# EAGLE schematic esp32-gps-eth-v9exp (EAGLE 7.3.0)
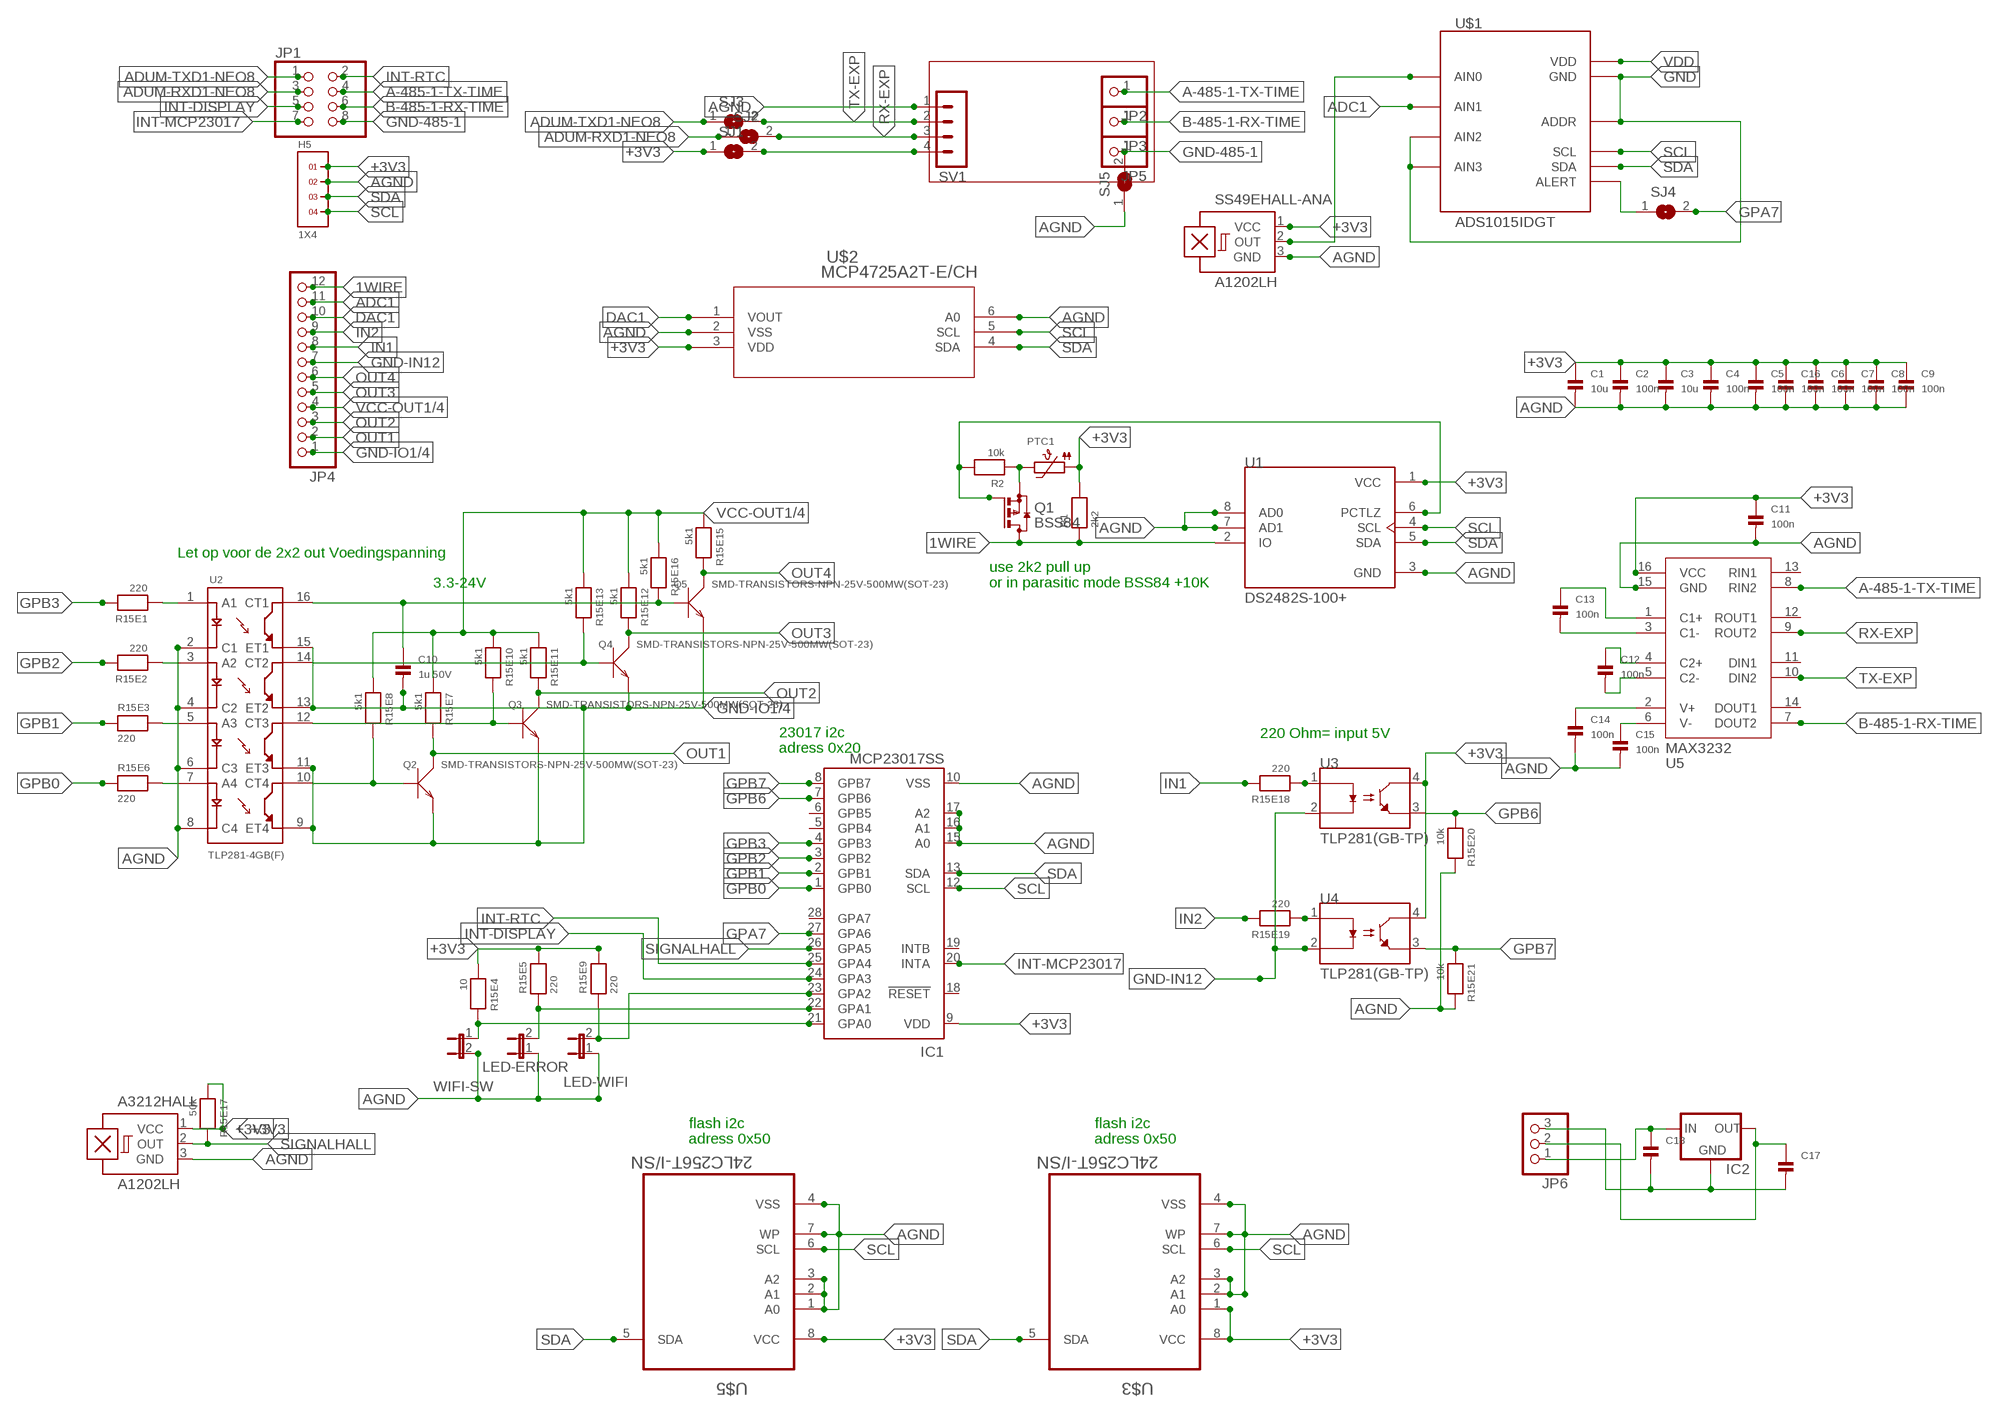
[diagram p0: schematic, sheet 1]

## Parts
A3212HALL  A1202LH  [SOT23-W]
C1  10u  CAP_CERAMIC0805  [0805]
C2  100n  CAP_CERAMIC0805  [0805]
C3  10u  CAP_CERAMIC0805  [0805]
C4  100n  CAP_CERAMIC0805  [0805]
C5  100n  CAP_CERAMIC0805  [0805]
C6  100n  CAP_CERAMIC0805  [0805]
C7  100n  CAP_CERAMIC0805  [0805]
C8  100n  CAP_CERAMIC0805  [0805]
C9  100n  CAP_CERAMIC0805  [0805]
C10  1u 50V  CAP_CERAMIC0805  [0805]
C11  100n  CAP_CERAMIC0805  [0805]
C12  100n  CAP_CERAMIC0805  [0805]
C13  100n  CAP_CERAMIC0805  [0805]
C14  100n  CAP_CERAMIC0805  [0805]
C15  100n  CAP_CERAMIC0805  [0805]
C16  100n  CAP_CERAMIC0805  [0805]
C17  CAP_CERAMIC0805  [0805]
C18  CAP_CERAMIC0805  [0805]
H5  1X4  [1X4]
IC1  MCP23017SS  [SSOP28]
IC2  LM1117TO263  [TO263]
JP1  PINHD-2X4  [2X04]
JP2  PINHD-1X1  [1X01]
JP3  PINHD-1X1  [1X01]
JP4  PINHD-1X12  [1X12]
JP5  PINHD-1X1  [1X01]
JP6  PINHD-1X3  [1X03]
LED-ERROR  JP1E  [JP1]
LED-WIFI  JP1E  [JP1]
PTC1  PTC1206  [1206]
Q1  BSS84  [SOT23]
Q2  SMD-TRANSISTORS-NPN-25V-500MW(SOT-23)  [SOT-23]
Q3  SMD-TRANSISTORS-NPN-25V-500MW(SOT-23)  [SOT-23]
Q4  SMD-TRANSISTORS-NPN-25V-500MW(SOT-23)  [SOT-23]
Q5  SMD-TRANSISTORS-NPN-25V-500MW(SOT-23)  [SOT-23]
R1  2k2  RESISTOR0805  [0805]
R2  10k  RESISTOR0805  [0805]
R15E1  220  RESISTOR_0805  [_0805]
R15E2  220  RESISTOR_0805  [_0805]
R15E3  220  RESISTOR_0805  [_0805]
R15E4  10  RESISTOR_0805  [_0805]
R15E5  220  RESISTOR_0805  [_0805]
R15E6  220  RESISTOR_0805  [_0805]
R15E7  5k1  RESISTOR_0805  [_0805]
R15E8  5k1  RESISTOR_0805  [_0805]
R15E9  220  RESISTOR_0805  [_0805]
R15E10  5k1  RESISTOR_0805  [_0805]
R15E11  5k1  RESISTOR_0805  [_0805]
R15E12  5k1  RESISTOR_0805  [_0805]
R15E13  5k1  RESISTOR_0805  [_0805]
R15E15  5k1  RESISTOR_0805  [_0805]
R15E16  5k1  RESISTOR_0805  [_0805]
R15E17  50k  RESISTOR_0805  [_0805]
R15E18  220  RESISTOR_0805  [_0805]
R15E19  220  RESISTOR_0805  [_0805]
R15E20  10k  RESISTOR_0805  [_0805]
R15E21  10k  RESISTOR_0805  [_0805]
SJ1  SJ  [SJ]
SJ2  SJ  [SJ]
SJ3  SJ  [SJ]
SJ4  SJ  [SJ]
SJ5  SJ  [SJ]
SS49EHALL-ANA  A1202LH  [SOT23-W]
SV1  MA04-1  [MA04-1]
U1  DS2482S-100+  [SOIC127P600X175-8N]
U2  TLP281-4GB(F)  [SOIC127P700X210-16N]
U3  TLP281(GB-TP)  [SOIC127P700X210-4N]
U4  TLP281(GB-TP)  [SOIC127P700X210-4N]
U5  MAX3232  [SO16]
U$1  ADS1015IDGT  [MSOP10_0.5]
U$2  MCP4725A2T-E/CH  [SOT-23-6_MC]
U$3  24LC256T-I/SN  [SOIC127P600X175-8N]
U$5  24LC256T-I/SN  [SOIC127P600X175-8N]
WIFI-SW  JP1E  [JP1]

## Nets
1WIRE: JP4.12 Q1.3(D) R1.1 U1.2(IO)
5VIN: C18.1 IC2.3(IN) JP6.1
+3V3: A3212HALL.1(VCC) C1.1 C2.1 C3.1 C4.1 C5.1 C6.1 C7.1 C8.1 C9.1 C11.1 C16.1 H5.1 IC1.9(VDD) PTC1.1 R1.2 R15E4.1 R15E5.2 R15E9.2 R15E17.1 SJ1.1 SS49EHALL-ANA.1(VCC) U1.1(VCC) U3.4(COLLECTOR) U4.4(COLLECTOR) U5.16(VCC) U$2.3(VDD) U$3.1(A0) U$3.8(VCC) U$5.8(VCC)
A-485-1-TX-TIME: JP1.4 JP2.1 U5.8(RIN2)
ADC1: JP4.11 U$1.5(AIN1)
ADUM-RXD1-NEO8: JP1.3 SJ2.1
ADUM-TXD1-NEO8: JP1.1 SJ3.1
AGND: A3212HALL.3(GND) C1.2 C2.2 C3.2 C4.2 C5.2 C6.2 C7.2 C8.2 C9.2 C11.2 C14.2 C15.2 C16.2 H5.2 IC1.10(VSS) IC1.15(A0) IC1.16(A1) IC1.17(A2) LED-ERROR.1 LED-WIFI.1 R15E20.2 R15E21.2 SJ5.1 SS49EHALL-ANA.3(GND) SV1.1 U1.3(GND) U1.7(AD1) U1.8(AD0) U2.2(C1) U2.4(C2) U2.6(C3) U2.8(C4) U5.15(GND) U$2.2(VSS) U$2.6(A0) U$3.2(A1) U$3.3(A2) U$3.4(VSS) U$3.7(WP) U$5.1(A0) U$5.2(A1) U$5.3(A2) U$5.4(VSS) U$5.7(WP) WIFI-SW.2
ANALOG: SS49EHALL-ANA.2(OUT) U$1.4(AIN0)
B-485-1-RX-TIME: JP1.6 JP3.1 U5.7(DOUT2)
DAC1: JP4.10 U$2.1(VOUT)
GND: U$1.1(ADDR) U$1.3(GND) U$1.6(AIN2) U$1.7(AIN3)
GND-485-1: JP1.8 JP5.1 SJ5.2
GND-IN: C17.2 C18.2 IC2.1(GND) JP6.3
GND-IN12: JP4.7 U3.2(CATHODE) U4.2(CATHODE)
GND-IO1/4: C10.2 JP4.1 Q2.2(E) Q3.2(E) Q4.2(E) Q5.2(E) U2.9(ET4) U2.11(ET3) U2.13(ET2) U2.15(ET1)
GPA7: IC1.27(GPA6) SJ4.2
GPB0: IC1.1(GPB0) R15E6.1
GPB1: IC1.2(GPB1) R15E3.1
GPB2: IC1.3(GPB2) R15E2.2
GPB3: IC1.4(GPB3) R15E1.2
GPB6: IC1.7(GPB6) R15E20.1 U3.3(EMITTER)
GPB7: IC1.8(GPB7) R15E21.1 U4.3(EMITTER)
IN1: JP4.8 R15E18.2
IN2: JP4.9 R15E19.2
INT-DISPLAY: IC1.24(GPA3) JP1.5
INT-MCP23017: IC1.20(INTA) JP1.7
INT-RTC: IC1.25(GPA4) JP1.2
N$1: PTC1.2 Q1.2(S) R2.1
N$2: C13.1 U5.1(C1+)
N$3: SJ1.2 SV1.4
N$4: Q1.1(G) R2.2 U1.6(PCTLZ)
N$5: Q2.1(B) R15E8.2 U2.10(CT4)
N$6: R15E2.1 U2.3(A2)
N$7: R15E1.1 U2.1(A1)
N$8: IC1.21(GPA0) R15E4.2 WIFI-SW.1
N$9: IC1.22(GPA1) LED-ERROR.2 R15E5.1
N$10: IC1.23(GPA2) LED-WIFI.2 R15E9.1
N$11: R15E3.2 U2.5(A3)
N$12: R15E6.2 U2.7(A4)
N$13: Q3.1(B) R15E10.2 U2.12(CT3)
N$14: Q4.1(B) R15E13.2 U2.14(CT2)
N$15: C10.1 Q5.1(B) R15E16.2 U2.16(CT1)
N$16: C13.2 U5.3(C1-)
N$17: R15E19.1 U4.1(ANODE)
N$18: R15E18.1 U3.1(ANODE)
N$19: SJ4.1 U$1.2(ALERT)
N$20: C12.1 U5.4(C2+)
N$21: C12.2 U5.5(C2-)
N$25: C14.1 U5.2(V+)
N$26: C15.1 U5.6(V-)
OUT1: JP4.2 Q2.3(C) R15E7.2
OUT2: JP4.3 Q3.3(C) R15E11.2
OUT3: JP4.5 Q4.3(C) R15E12.2
OUT4: JP4.6 Q5.3(C) R15E15.2
RX-EXP: SJ2.2 SV1.3 U5.9(ROUT2)
SCL: H5.4 IC1.12(SCL) U1.4(SCL) U$1.10(SCL) U$2.5(SCL) U$3.6(SCL) U$5.6(SCL)
SDA: H5.3 IC1.13(SDA) U1.5(SDA) U$1.9(SDA) U$2.4(SDA) U$3.5(SDA) U$5.5(SDA)
SIGNALHALL: A3212HALL.2(OUT) IC1.26(GPA5) R15E17.2
TX-EXP: SJ3.2 SV1.2 U5.10(DIN2)
VCC-OUT1/4: JP4.4 R15E7.1 R15E8.1 R15E10.1 R15E11.1 R15E12.1 R15E13.1 R15E15.1 R15E16.1
VDD: U$1.8(VDD)
VOUT: C17.1 IC2.2(OUT) JP6.2
Unconnected: IC1.5(GPB4) IC1.6(GPB5) IC1.18(!RESET) IC1.19(INTB) IC1.28(GPA7) U5.11(DIN1) U5.12(ROUT1) U5.13(RIN1) U5.14(DOUT1)

## Notes on the sheet
- Let op voor de 2x2 out Voedingspanning
- 3.3-24V
- use 2k2 pull up
  or in parasitic mode BSS84 +10K
- 220 Ohm= input 5V
- 23017 i2c 
  adress 0x20
- flash i2c
  adress 0x50
- flash i2c
  adress 0x50

## Library data of the parts
A3212HALL SS49EHALL-ANA = allegro:A12*?: Hall-effect bipolar switch Source: http://www.allegromicro.com/en/Products/Part_Numbers/1202/1202.pdf; OC_FARNELL: unknown; OC_NEWARK: unknown
C1-C18 = microbuilder:CAP_CERAMIC: Ceramic Capacitors 0402 - 0402 Surface Mount Capacitors 16pF 50V 5% [Digikey: 445-4899-2-ND] 18pF 50V 5% [Digikey: 490-1281-2-ND] 22pF 50V 5% [Digikey: 490-1283-2-ND] 68pF 50V 5% [Digikey: 490-1289-2-ND] 0.1uF 10V 10% [Digikey: 490-1318-2-ND] 1.0uF 6.3V 10% [Digikey: 490-1320-2-ND] 0603 - 0603 Surface Mount Capacitors 16 pF 50V 5% [Digikey: 445-5051-2-ND] 22 pF 50V [Digikey: PCC220ACVTR-ND] 33 pF 50V 5% [Digikey: 490-1415-1-ND] 56pF 50V 5% [Digikey: 490-1421-1-ND] 220pF 50V 5% [Digikey: 445-1285-1-ND] 680 pF 50V 2200 pF 50V 5% C0G [Digikey: 445-1297-1-ND] 5600 pF 100V 5% X7R [Digikey: 478-3711-1-ND] 0.1 µF 25V 10% [Digikey: PCC2277TR-ND] 0.22 µF 16V 10% X7R [Digikey: 445-1318-1-ND] 1.0 µF 25V 10% [Digikey: 445-5146-2-ND] 0603 - RF Specific 3pF 250V +/-0.1pF RF [Digikey: 712-1347-1-ND] 18 pF 250V 5% [Digikey: 478-3505-1-ND or 712-1322-1-ND] 56 pF 250V 5% C0G RF [Digikey: 490-4867-1-ND] 68 pF 250V RF [Digikey: 490-4868-1-ND] 0805 - 0805 Surface Mount Capacitors 220 pF 250V 2% RF Ceramic Capacitor [Digikey: 712-1398-1-ND] 1000 pF 50V 2% NP0 Ceramic Capacitor [Digikey: 478-3760-1-ND] 0.1 µF 25V 10% Ceramic Capacitor [Digikey: PCC1828TR-ND] 1.0 µF 16V 10% Ceramic Capacitor[Digikey: 490-1691-2-ND] 10.0 µF 10V 10% Ceramic Capacitor[Digikey: 709-1228-1-ND] 10.0 uF 16V 10% Ceramic Capacitor [Digikey: 478-5165-2-ND] 47 uF 6.3V 20% Ceramic Capacitor [Digikey: 587-1779-1-ND or 399-5506-1-ND] 1206 - 1206 Surface Mount Capacitors 47uF 10V 20% Ceramic Capacitor [Digikey: 490-5528-1-ND or 399-5508-1-ND or 445-6010-1-ND] 100uF 6.3V -20%, +80% Y5V Ceramic Capacitor (Digikey: 490-4512-1-ND, Mouser: 81-GRM31CF50J107ZE1L)
H5 = headers(.1in):1X4
IC1 = microchip:MCP23017: http://ww1.microchip.com/downloads/en/DeviceDoc/21952a.pdf Source: http://ww1.microchip.com/downloads/en/DeviceDoc/21952a.pdf; MF: MICROCHIP; MPN: MCP23017-E/SS; OC_FARNELL: 1467674; OC_NEWARK: 31K2960
IC2 = v-reg-3:LM1117
JP1 = adafruit:PINHD-2X4: PIN HEADER
JP2 JP3 JP5 = adafruit:PINHD-1X1: Pin header 1x1 for 0.1" spacing With round pins
JP4 = adafruit:PINHD-1X12: PIN HEADER
JP6 = adafruit:PINHD-1X3: PIN HEADER
LED-ERROR LED-WIFI WIFI-SW = jumper:JP1E: JUMPER
PTC1 = microbuilder:PTC: PTC (Resettable Fuse) 1206 Package 250mA PTC (16V Max, Time-to-Trip: 0.08s) - Digikey: F2110CT-ND 1210 Package 100mA PTC (30V Max, Time-to-Trip: 0.6s) - Digikey: MF-USMF010-2CT-ND 1812 Package 750mA PTC (24V Max, Time-to-Trip: 0.2s) - Digikey: MF-MSMF075/24-2CT-ND
Q1 = transistor-small-signal:BSS84: P-CHANNEL MOS FET
Q2-Q5 = SMD-TRANSISTORS-NPN-25V-500MW_SOT-23_:SMD-TRANSISTORS-NPN-25V-500MW(SOT-23): 305010017; AVAILABILITY: Unavailable; MF: Micro Commercial; MP: S8050; PACKAGE: SOT-23 Micro Commercial; PRICE: None
R1 R2 R15E1-R15E13 R15E15-R15E21 = microbuilder:RESISTOR: Resistors 0402 - 0402 Surface Mount Package 22 Ohm 1% 1/16W [Digikey: 311-22.0LRTR-ND] 33 Ohm 5% 1/16W 1.0K 5% 1/16W 1.5K 5% 1/16W 2.0K 1% 1/16W 10.0K 1% 1/16W [Digikey: 311-10.0KLRTR-ND] 10.0K 5% 1/16W [Digikey: RMCF0402JT10K0TR-ND] 12.1K 1% 1/16W [Digikey: 311-22.0LRTR-ND] 100.0K 5% 1/16W 0603 - 0603 Surface Mount Package 0 Ohm 1/10 Watt 1% Resistor 15 Ohm 1/10 Watt 1% Resistor 33 Ohm 1/10 Watt 1% Resistor 49.9 Ohm 1/10 Watt 1% Resistor 100 Ohm 1/10 Watt 1% Resistor 150 Ohm 1/10 Watt 1% Resistor 240 Ohm 1/10 Watt 1% Resistor 390 Ohm 1/10 Watt 1% Resistor 560 Ohm 1/10 Watt 1% Resistor 680 Ohm 1/10 Watt 1% Resistor 750 Ohm 1/10 Watt 1% Resistor 1.0K Ohm 1/10 Watt 1% Resistor 1.5K Ohm 1/10 Watt 1% Resistor 2.0K Ohm 1/10 Watt 1% Resistor 2.2K Ohm 1/10 Watt 1% Resistor 3.3K Ohm 1/10 Watt 1% Resistor 4.7K Ohm 1/10 Watt 1% Resistor 10.0K Ohm 1/10 Watt 1% Resistor 12.0K Ohm 1/10 Watt 1% Resistor 12.1K Ohm 1/10 Watt 1% Resistor 20.0K Ohm 1/10 Watt 1% Resistor 33.0K Ohm 1/10 Watt 1% Resistor 100.0K Ohm 1/10 Watt 1% Resistor 0805 - 0805 Surface Mount Package 0 Ohm 1/8 Watt 1% Resistor 33 Ohm 1/8 Watt 1% Resistor 100 Ohm 1/8 Watt 1% Resistor 150 Ohm 1/8 Watt 1% Resistor 200 Ohm 1/8 Watt 1% Resistor 240 Ohm 1/8 Watt 1% Resistor 330 Ohm 1/8 Watt 1% Resistor 390 Ohm 1/8 Watt 1% Resistor 470 Ohm 1/8 Watt 1% Resistor 1.0K Ohm 1/8 Watt 1% Resistor 1.5K Ohm 1/8 Watt 1% Resistor 2.0K Ohm 1/8 Watt 1% Resistor 4.7K Ohm 1/8 Watt 1% Resistor 5.1K Ohm 1/8 Watt 1% Resistor 5.6K Ohm 1/8 Watt 1% Resistor 10.0K Ohm 1/8 Watt 1% Resistor 22.0K Ohm 1/8 Watt 1% Resistor 33.0K Ohm 1/8 Watt 1% Resistor 100K Ohm 1/8 Watt 1% Resistor 1206 - 1206 Surface Mount Package 2012 - 2010 Surface Mount Package 0.11 Ohm 1/2 Watt 1% Resistor - Digikey: RHM.11UCT-ND
SJ1-SJ5 = jumper:SJ: SMD solder JUMPER
SV1 = con-lstb:MA04-1: PIN HEADER; OC_FARNELL: unknown; OC_NEWARK: unknown
U1 = DS2482S-100_:DS2482S-100+: DS2460S Series 5.5 V 400 kHz I2C Surface Mount Smart Card Interface IC - SOIC-8; AVAILABILITY: Unavailable; DESCRIPTION: I²C to 1-wire Interface-IC [Maxim] DS2482S-100+ I²C to 1-wire Interface-IC; MF: Maxim Integrated; MP: DS2482S-100+; PACKAGE: SOIC-8 Maxim; PRICE: None
U2 = TLP281-4GB_F_:TLP281-4GB(F): Optocoupler DC-IN 4-CH Transistor DC-OUT 16-Pin SOP; AVAILABILITY: Unavailable; DESCRIPTION: Optocoupler DC-IN 4-CH Transistor DC-OUT 16-Pin SOP; MF: Toshiba; MP: TLP281-4GB_F_; PACKAGE: SOP-16 Toshiba; PRICE: None
U3 U4 = TLP281_GB-TP_:TLP281(GB-TP): Optocoupler DC-IN 1-CH Transistor DC-OUT 4-Pin SOP T/R; AVAILABILITY: Unavailable; DESCRIPTION: Optocoupler DC-IN 1-CH Transistor DC-OUT 4-Pin SOP T/R; MF: Toshiba Semiconductor; MP: TLP281_GB-TP_; PACKAGE: SOP-4 Toshiba; PRICE: None
U5 = MAX3232:MAX3232: RS-232 Line Driver/Receiver; AVAILABILITY: Unavailable; MF: Texas Instruments; MP: MAX3232; PACKAGE: SOIC-16 Texas Instruments; PRICE: None
U$1 = ADS1015:ADS1015: Ti ADS1015 12-bit ADC Ultra-Small, Low-Power, 12-Bit Analog-to-Digital Converter with Internal Reference The ADS1013, ADS1014, and ADS1015 are precision analog-to-digital converters (ADCs) with 12 bits of resolution offered in an ultra-small, leadless QFN-10 package or an MSOP-10 package. \ Source: http://focus.ti.com/docs/prod/folders/print/ads1015.html; AVAILABILITY: Unavailable; DESCRIPTION: 12-Bit ADC with Integrated MUX PGA Comparator Oscillator and Reference; MF: Texas Instruments; MP: ADS1015; PACKAGE: XFQFN-10 Texas Instruments; PRICE: None
U$2 = MCP4725A2T-E_CH:MCP4725A2T-E/CH; AVAILABILITY: Unavailable; DESCRIPTION: MCP4725 Series 1 Ch I2C EEPROM Memory 5.5 V 12-Bit D/A Converter SMT - SOT-23-6; MF: Microchip; MP: MCP4725A2T-E/CH; PACKAGE: SOT-23-6 Microchip; PRICE: None
U$3 U$5 = Microchip_By_element14_Batch_1:24LC256T-I/SN: 256K I2C CMOS Serial EEPROM; MPN: 24LC256T-I/SN; OC_FARNELL: 1296581; OC_NEWARK: 27C9147; PACKAGE: SOIC-8; SUPPLIER: MICROCHIP